# EasyEDA Pro project ProProject_Strain Gauge Paddle_2023-12-18.epro, board PCB1
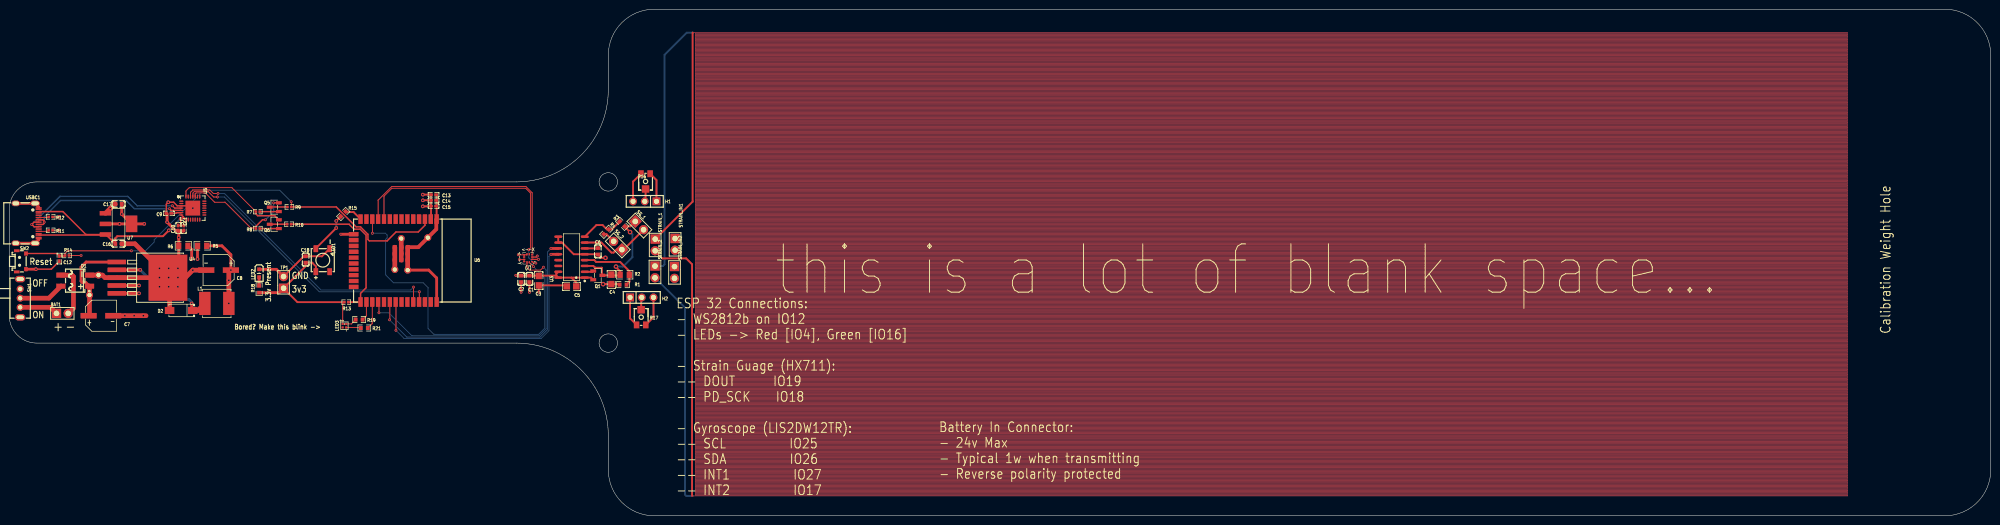
[diagram p3: board, top side]
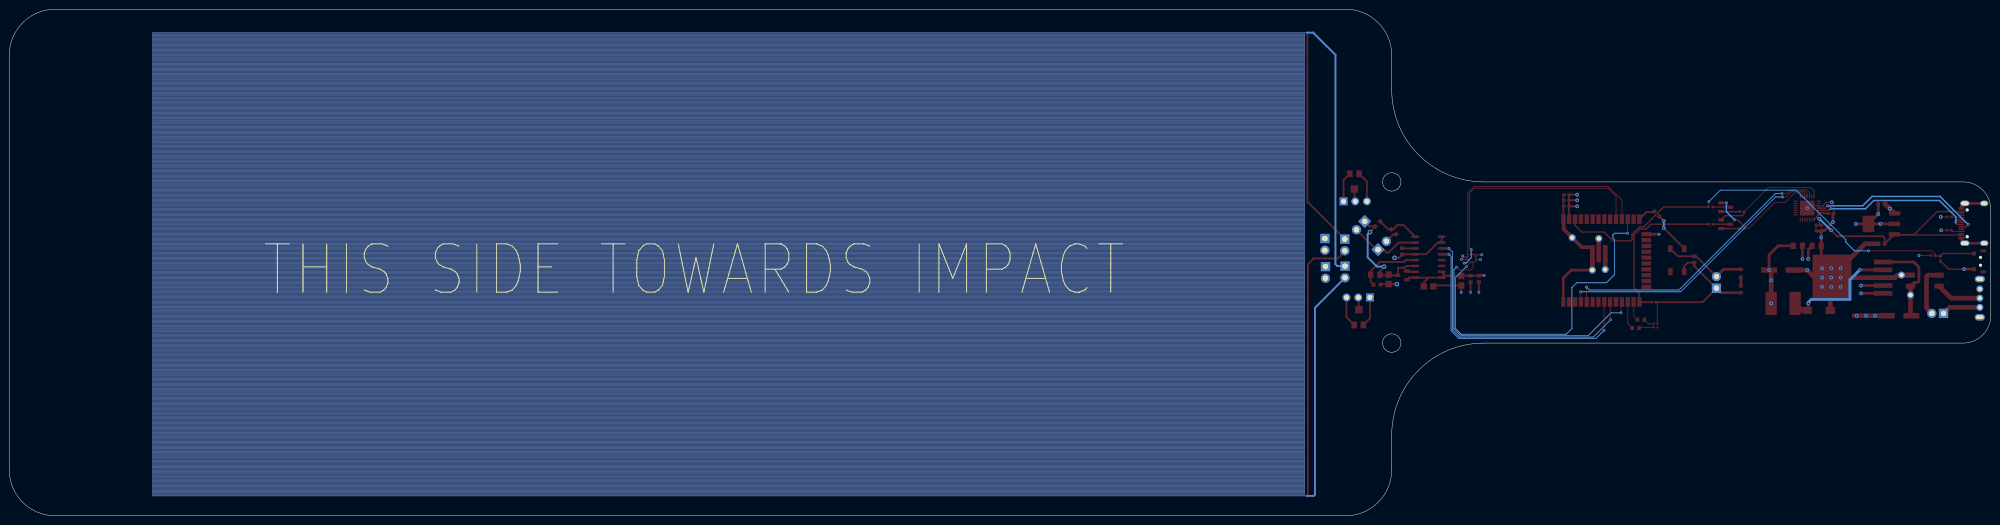
[diagram p4: board, bottom side, seen from below]

Outline 430 x 110 mm; copper layers: Top Layer, GND, 3V3, Bottom Layer. Coordinates in mm from the lower left corner of the outline.
Outline path: circle c130,72.5 r2 ; circle c130,37.5 r2 ; 0,66.5 arc(1.76,70.74) 6,72.5 110,72.5 arc(124.14,78.36) 130,92.5 130,100 arc(132.93,107.07) 140,110 420,110 arc(427.07,107.07) 430,100 430,10 arc(427.07,2.93) 420,0 140,0 arc(132.93,2.93) 130,10 130,17.5 arc(124.14,31.64) 110,37.5 6,37.5 arc(1.76,39.26) 0,43.5 0,66.5
Stack: Top Layer 0.035mm / Dielectric1 0.48mm PP er 4.5 / GND 0.035mm / Dielectric2 0.48mm FR4 er 4.5 / 3V3 0.035mm / Dielectric3 0.48mm PP er 4.5 / Bottom Layer 0.035mm

## Design rules (mm)
template: JLCPCB Capability(Two Layers Board)
spacing copperThickness1oz (default): track to track 0.102, other pairs 0.152 to 0.3
spacing copperThickness2oz: track to track 0.203, other pairs 0.152 to 0.3
track width copperThickness1oz (default): min 0.127, default 0.254, max 2.54
track width copperThickness2oz: min 0.203, default 0.254, max 2.54
differential pair differentialPair (default): width min 0.127, default 0.254, max 2.54; gap min 0.152, default 0.152
via viaSize (default): diameter min 0.5, default 0.61, max 10; hole min 0.3, default 0.305, max 6.3

## Placement (name value [footprint] x y rotation side)
BAT1  PZ254V-11-02P  [HDR-TH_2P-P2.54-V-M]  11.53 43.95 0 top
C1  100nF  [C0603]  112.88 51.44 90 top
C2  100nF  [C0603]  111.09 51.44 90 top
C3  10uF  [C0805]  114.92 51.06 90 top
C4  10uF  [C0805]  130.66 51.33 90 top
C5  10uF  [C0805]  122.02 49.81 180 top
C6  100nF  [C0603]  127.74 57.43 90 top
C7  470uF  [CAP-SMD_BD6.3-L6.6-W6.6-LS7.6-RD]  19.91 43.44 0 top
C8  330uF  [CAP-SMD_BD6.3-L6.6-W6.6-LS7.4-FD]  45.44 53.35 180 top
C9  100nF  [C0402]  34.64 65.67 0 top
C10  1uF  [C0402]  36.67 62.49 90 top
C11  100nF  [C0402]  37.9 62.49 90 top
C12  10uF  [C0402]  10.89 55.85 270 top
C13  10uF  [C0402]  92.08 69.73 180 top
C14  10uF  [C0402]  92.08 68.5 180 top
C15  10uF  [C0402]  92.08 67.23 180 top
C16  10uF  [C0603]  23.72 59.06 0 top
C17  10uF  [C0603]  23.72 67.7 180 top
C18  10uF  [C0603]  64.33 55.66 90 top
D1  MB10S  [MBS_L4.7-W3.8-P2.40-LS7.0-TL]  14.32 51.06 180 top
D2  SS54  [SMA_L4.4-W2.8-LS5.4-R-RD]  37.31 44.59 180 top
H1  PZ254V-11-03P  [HDR-TH_3P-P2.54-V-M]  137.91 68.28 180 top
H2  PZ254V-11-03P  [HDR-TH_3P-P2.54-V-M]  137.26 47.41 0 top
L1  22uH  [IND-SMD_L6.0-W6.0_SWPA6045S]  45.05 46.11 0 top
LED1  XL-5050RGBC-WS2812B  [LED-SMD_4P-L5.0-W5.0-BL_XL-5050RGBC]  68.04 55.51 0 top
LED2  BL-HJC36G-AV-TRB  [LED0603-R-RD_AMBER]  54.23 52.67 270 top
LED3  NH-B1010RGBT-HF  [LED-ARRAY-SMD_4P-L1.0-W1.0-TR_NH-B1010RGBT]  72.74 41.28 90 top
NOREF  -  [Pad_e5196]  83.67 53.48 0 top
NOREF#2  -  [Pad_e5195]  85.07 60.21 0 top
NOREF#3  -  [Pad_e6579]  17.42 47.93 0 top
NOREF#4  -  [Pad_e6573]  19.38 52.26 0 top
NOREF#5  -  [Pad_e5197]  86.47 53.35 0 top
NOREF#6  -  [Pad_e5198]  90.84 60.4 0 top
Q1  S8550  [SOT-23-3_L2.9-W1.3-P1.90-LS2.4-BR]  127.73 52.21 180 top
Q5  -  [SOT-23-3_L2.9-W1.3-P1.90-LS2.4-BR]  57.52 67.01 0 top
Q6  -  [SOT-23-3_L2.9-W1.3-P1.90-LS2.4-BR]  57.52 63.31 0 top
R1  6.65kΩ  [R0603]  133.2 50.19 0 top
R2  10kΩ  [R0805]  133.57 52.33 180 top
R3  1kΩ  [R0603]  133.02 63.38 135 top
R4  1kΩ  [R0603]  129.56 61.66 225 top
R5  0Ω  [R0805]  41.86 58.62 0 top
R6  0Ω  [R0805]  37.79 58.62 0 top
R7  10kΩ  [R0402]  53.94 66.05 0 top
R8  10kΩ  [R0402]  53.94 62.37 0 top
R9  100Ω  [R0402]  60.8 67.06 0 top
R10  100Ω  [R0402]  60.73 63.31 0 top
R11  5.1kΩ  [R0402]  8.99 61.98 180 top
R12  5.1kΩ  [R0402]  8.99 64.91 180 top
R13  10kΩ  [R0402]  73.14 46.39 180 top
R14  10kΩ  [R0402]  12.54 56.52 0 top
R15  330Ω  [R0603]  72.49 65.54 45 top
R16  300Ω  [RES-ADJ-SMD_VG039NCH]  138.08 72.62 90 top
R17  300Ω  [RES-ADJ-SMD_VG039NCH]  137.14 43.1 270 top
R18  100Ω  [R0603]  54.23 49.2 270 top
R19  100Ω  [R0603]  77.06 40.78 0 top
R21  100Ω  [R0603]  75.94 42.6 180 top
SG_1  PZ254V-11-02P  [HDR-TH_2P-P2.54-V-M]  136.75 63.02 315 top
SG_2  PZ254V-11-02P  [HDR-TH_2P-P2.54-V-M]  132.05 58.7 135 top
STRAIN_1  PZ254V-11-02P  [HDR-TH_2P-P2.54-V-M]  140.18 58.81 270 top
STRAIN_2  PZ254V-11-02P  [HDR-TH_2P-P2.54-V-M]  140.13 52.95 270 top
STRAIN_IN1  PZ254V-11-02P  [HDR-TH_2P-P2.54-V-M]  144.5 58.94 270 top
STRAIN_IN2  PZ254V-11-02P  [HDR-TH_2P-P2.54-V-M]  144.37 52.84 270 top
SW1  SK12D07VG4  [SW-TH_SK12D07VG4]  2.38 47.26 270 top
SW2  1TS003B-1400-3500A-CT  [KEY-SMD_1TS003B]  2.64 55.25 270 top
TP1  -  [HDR-TH_2P-P2.54-V-M]  59.53 50.68 90 top
U2  LIS2DW12TR  [LGA-12_L2.0-W2.0-P0.50-BL]  112.61 55.93 90 top
U3  HX711  [SOP-16_L10.0-W3.9-P1.27-LS6.0-BL]  122.02 56.16 90 top
U4  LM2575S-3.3  [TO-263-5_L10.0-W8.4-P1.70-LS15.3-BR]  28.9 51.7 180 top
U5  -  [WQFN-28_L5.0-W5.0-P0.50-BL-EP3.2]  39.85 66.81 270 top
U6  -  [WIFI-SMD_ESP32-WROOM-32E]  83.75 55.42 180 top
U7  AMS1117-3.3  [SOT-223-4_L6.5-W3.5-P2.30-LS7.0-BR]  23.72 63.38 180 top
USBC1  -  [USB-C_SMD-TYPE-C-31-M-12]  3.91 63.51 270 top

## Footprints (pads in the part's own frame, mm; a bottom-side part is the same pattern mirrored in y, then rotated)
C0402
  rect 0.79x0.54 smd: 1(-0.545,0) 2(0.545,0)
C0603
  rect 0.8x0.9 smd: 1(-0.7,0) 2(0.7,0)
C0805
  rect 1.41x1.35 smd: 1(-1.03,0) 2(1.03,0)
CAP-SMD_BD6.3-L6.6-W6.6-LS7.4-FD
  rect 3.5x1.2 smd: 1(-2.67,0) 2(2.67,0)
CAP-SMD_BD6.3-L6.6-W6.6-LS7.6-RD
  rect 3.5x1.2 smd: 1(-2.67,0) 2(2.67,0)
HDR-TH_2P-P2.54-V-M
  rect 2x2 hole 1.2: 1(-1.27,0)
  round 2 hole 1.2: 2(1.27,0)
HDR-TH_3P-P2.54-V-M
  rect 1.7x1.7 hole 1.1: 1(-2.54,0)
  round 1.7 hole 1.1: 2(0,0) 3(2.54,0)
IND-SMD_L6.0-W6.0_SWPA6045S
  rect 2.474x5.02 smd: 1(-2.603,0) 2(2.603,0)
KEY-SMD_1TS003B
  rect 0.9x0.8 smd: 1(1.7,1) 2(-1.7,1)
  rect 0.6x1.2 smd: 3(-2.3,-1) 4(2.3,-1)
LED0603-R-RD_AMBER
  rect 0.8x0.8 smd: 1(0.851,0) 2(-0.851,0)
LED-ARRAY-SMD_4P-L1.0-W1.0-TR_NH-B1010RGBT
  rect 0.45x0.45 smd: 1(0.385,0.385) 2(0.385,-0.385) 3(-0.385,-0.385) 4(-0.385,0.385)
LED-SMD_4P-L5.0-W5.0-BL_XL-5050RGBC
  rect 1x1.5 smd: 1(-1.5,-2.5) 2(1.5,-2.5) 3(1.5,2.5) 4(-1.5,2.5)
LGA-12_L2.0-W2.0-P0.50-BL
  rect 0.28x0.5 smd: 1(-0.75,-0.875) 2(-0.25,-0.875) 3(0.25,-0.875) 4(0.75,-0.875) 7(0.75,0.875) 8(0.25,0.875) 9(-0.25,0.875) 10(-0.75,0.875)
  rect 0.5x0.28 smd: 5(0.875,-0.25) 6(0.875,0.25) 11(-0.875,0.25) 12(-0.875,-0.25)
MBS_L4.7-W3.8-P2.40-LS7.0-TL
  rect 2x1.1 smd: 1(-3.1,1.2) 2(-3.1,-1.2) 3(3.1,-1.2) 4(3.1,1.2)
Pad_e5195
  round 1.524 hole 0.914: 1(0,0)
Pad_e5196
  round 1.524 hole 0.914: 2(0,0)
Pad_e5197
  round 1.524 hole 0.914: 3(0,0)
Pad_e5198
  round 1.524 hole 0.914: 4(0,0)
Pad_e6573
  round 1.524 hole 0.914: 5(0,0)
Pad_e6579
  round 1.524 hole 0.914: 6(0,0)
R0402
  rect 0.566x0.54 smd: 1(-0.433,0) 2(0.433,0)
R0603
  rect 0.806x0.864 smd: 1(-0.753,0) 2(0.753,0)
R0805
  rect 1.133x1.377 smd: 1(-1,0) 2(1,0)
RES-ADJ-SMD_VG039NCH
  rect 1.5x1.2 smd: 1(1.65,-1) 3(1.65,1)
  rect 1.6x1.6 smd: 2(-1.65,0)
SMA_L4.4-W2.8-LS5.4-R-RD
  rect 2.062x1.539 smd: 1(2.503,0) 2(-2.503,0)
SOP-16_L10.0-W3.9-P1.27-LS6.0-BL
  oval 0.56x1.745 smd: 1(-4.445,-2.873) 2(-3.175,-2.873) 3(-1.905,-2.873) 4(-0.635,-2.873) 5(0.635,-2.873) 6(1.905,-2.873) 7(3.175,-2.873) 8(4.445,-2.873) 9(4.445,2.873) 10(3.175,2.873) 11(1.905,2.873) 12(0.635,2.873) 13(-0.635,2.873) 14(-1.905,2.873) 15(-3.175,2.873) 16(-4.445,2.873)
SOT-23-3_L2.9-W1.3-P1.90-LS2.4-BR
  rect 1.25x0.7 smd: 1(1,-0.95) 2(1,0.95) 3(-1,0)
SOT-223-4_L6.5-W3.5-P2.30-LS7.0-BR
  rect 2.47x0.98 smd: 1(2.835,-2.3) 2(2.835,0) 3(2.835,2.3)
  rect 2.47x3.6 smd: 4(-2.835,0)
SW-TH_SK12D07VG4
  round 1.524 hole 0.914: 1(-2,0) 2(0,0) 3(2,0)
  oval 1.4x2.2 hole 0.8x1.6: 4(4.15,0) 5(-4.15,0)
TO-263-5_L10.0-W8.4-P1.70-LS15.3-BR
  rect 4x1.02 smd: 1(5.55,-3.4) 2(5.55,-1.7) 3(5.55,0) 4(5.55,1.7) 5(5.55,3.4)
  rect 8.4x10 smd: 6(-5.55,0)
USB-C_SMD-TYPE-C-31-M-12
  oval 1.2x2 hole 0.8x1.6: 0(-4.325,1.716) 0(4.325,1.716)
  oval 1.2x1.8 hole 0.8x1.4: 0(-4.325,-2.484) 0(4.325,-2.484)
  rect 0.3x1.3 smd: A1(-3.35,2.484) A4(-2.55,2.484) A5(-1.25,2.484) A6(-0.25,2.484) A7(0.25,2.484) A8(1.25,2.484) A9(2.55,2.484) A12(3.35,2.484) B1(3.05,2.484) B4(2.25,2.484) B5(1.75,2.484) B6(0.75,2.484) B7(-0.75,2.484) B8(-1.75,2.484) B9(-2.25,2.484) B12(-3.05,2.484)
WIFI-SMD_ESP32-WROOM-32E
  rect 0.95x2.1 smd: 1(-9.002,-9) 2(-7.732,-9) 3(-6.463,-9) 4(-5.192,-9) 5(-3.922,-9) 6(-2.652,-9) 7(-1.383,-9) 8(-0.113,-9) 9(1.157,-9) 10(2.428,-9) 11(3.697,-9) 12(4.968,-9) 13(6.237,-9) 14(7.508,-9) 25(7.508,9) 26(6.237,9) 27(4.968,9) 28(3.697,9) 29(2.428,9) 30(1.157,9) 31(-0.113,9) 32(-1.383,9) 33(-2.652,9) 34(-3.922,9) 35(-5.192,9) 36(-6.463,9) 37(-7.732,9) 38(-9.002,9)
  rect 2.1x0.95 smd: 15(9.002,-5.715) 16(9.002,-4.445) 17(9.002,-3.175) 18(9.002,-1.905) 19(9.002,-0.635) 20(9.002,0.635) 21(9.002,1.905) 22(9.002,3.175) 23(9.002,4.445) 24(9.002,5.715)
  rect 0.9x0.9 smd: 39(-2.721,-0.1) 39(-2.721,-1.5) 39(-2.721,-2.9) 39(-1.321,-0.1) 39(-1.321,-1.5) 39(-1.321,-2.9) 39(0.079,-0.1) 39(0.079,-1.5) 39(0.079,-2.9)
WQFN-28_L5.0-W5.0-P0.50-BL-EP3.2
  oval 0.28x0.9 smd: 1(-1.502,-2.5) 2(-1.001,-2.5) 3(-0.5,-2.5) 4(0,-2.5) 5(0.5,-2.5) 6(1,-2.5) 7(1.501,-2.5) 15(1.501,2.5) 16(1,2.5) 17(0.5,2.5) 18(0,2.5) 19(-0.5,2.5) 20(-1.001,2.5) 21(-1.502,2.5)
  oval 0.9x0.28 smd: 8(2.5,-1.502) 9(2.5,-1.001) 10(2.5,-0.5) 11(2.5,0) 12(2.5,0.5) 13(2.5,1) 14(2.5,1.501) 22(-2.5,1.501) 23(-2.5,1) 24(-2.5,0.5) 25(-2.5,0) 26(-2.5,-0.5) 27(-2.5,-1.001) 28(-2.5,-1.502)
  rect 3.2x3.2 smd: 29(0,0)

## Nets
As in the schematic, except:
3V3: C1.2 C2.2 C3.2 C5.1 C8.1 C13.2 C14.2 C15.2 C17.1 C18.1 L1.2 LED1.1 LED3.1 Q1.2 R5.2 R13.2 R14.2 R18.2 TP1.1 U2.9 U2.10 U3.1 U3.15 U3.16 U6.2 U7.2 U7.4
AGND: C4.1 C6.1 R1.1 R4.2 SG_2.2 U3.5 U3.9 U3.10
GND: C1.1 C2.1 C3.1 C5.2 C7.2 C8.2 C9.1 C10.1 C11.1 C12.2 C13.1 C14.1 C15.1 C16.2 C17.2 C18.2 D1.2 D2.1 LED1.3 LED2.2 NOREF.2 NOREF#2.1 NOREF#4.5 NOREF#5.3 NOREF#6.4 R6.1 R11.1 R12.1 SW2.1 TP1.2 U2.6 U2.7 U2.8 U4.3 U4.6 U5.3 U5.29 U6.1 U6.15 U6.38 U6.39 U7.1 USBC1.0 USBC1.A1 USBC1.A12 USBC1.B1 USBC1.B12
BATT_POS: C7.1 D1.1 NOREF#3.6 U4.1

Pads without a net: LED1 2; LED3 4; SW1 1 4 5; SW2 3 4; U2 2 3 5; U3 13 14; U5 1 2 9 10 11 12 13 14 15 16 17 18 19 20 21 22 23 27; U6 4 5 6 7 8 9 13 16 17 18 19 20 21 22 23 24 29 32 33 36 37; USBC1 A8 B8

## Via types
v1: diameter 0.61, hole 0.305, Top Layer to Bottom Layer, 2 vias
v2: diameter 0.8, hole 0.4, Top Layer to Bottom Layer, 40 vias
v3: diameter 0.6, hole 0.3, Top Layer to Bottom Layer, 30 vias
v4: diameter 1, hole 0.5, Top Layer to Bottom Layer, 4 vias

## Routing (per net, layer and track width the routed paths; a pad name or vN(x,y) marks a point on that pad's centre or on a via; arc(x,y) is an arc through that point)
3V3: length 162.4
  Top Layer w0.2: 111.69,55.63 v3(110.71,55.63) ; 111.69,55.63 111.73,55.59 U2.10 ; 111.69,55.63 U2.9 ; R14.2 v3(15.59,56.52) ; LED3.1 72.36,46.03 R13.2
  Top Layer w0.4: C5.1 123.05,50.65 121.99,51.71 ; U6.2 91.53,64.47 C15.2 ; 118.72,52.14 U3.16 121.99,51.71 ; 118.72,52.14 118.72,52.55 U3.15 ; 118.72,52.14 C1.2 C2.2 ; C14.2 C15.2 ; C14.2 v2(89.76,68.5) ; C14.2 C13.2 v2(89.76,69.73) ; C15.2 arc(91.49,67.2) 91.43,67.19 v2(89.76,67.19) ; LED1.1 66.54,54.17 65.76,54.96 C18.1 64.33,54.21 TP1.1 62.56,46.39 R13.2 ; 121.99,51.71 U3.1 126.28,51.71 Q1.2
  Top Layer w0.6: R5.2 46.16,58.62 48.11,56.68 v2(48.11,53.35) ; v3(109.95,52.21) 111.03,52.21 C2.2 ; TP1.1 58.57,48.45 R18.2 ; C17.1 v2(24.42,65.52) U7.4 ; U7.4 v2(29.31,63.38) ; U7.4 v2(23.95,63.38) U7.2
  Top Layer w1: v2(48.11,53.35) 47.66,52.9 v2(47.66,51.14) v2(47.66,46.11)
  3V3 w0.2: v2(23.95,63.38) 23.97,63.35 23.97,62.11 18.38,56.52 v3(15.59,56.52)
  3V3 w0.6: 90.39,42.17 93.57,39 109.06,39 109.95,39.89 v3(109.95,52.21) 109.95,54.87 v3(110.71,55.63) ; v2(23.95,63.38) v2(29.31,63.38) 27.17,65.52 v2(24.42,65.52)
AGND: length 19.3
  Top Layer w0.4: v4(129.38,56.02) 128.45,56.02 C6.1 127.67,56.79 U3.5 122.51,56.79 119.97,59.33 U3.10 U3.9 ; 129.03,61.13 129.62,61.13 SG_2.2 ; R1.1 132.33,50.3 C4.1 ; 130.66,50.3 v4(128.87,50.3)
GND: length 179.6
  Top Layer w0.2: U2.7 112.23,56.68 U2.6 ; U2.7 U2.8 ; U2.7 v3(110.46,56.68) ; R12.1 10.76,64.91 ; R11.1 v2(10.76,61.98)
  Top Layer w0.3: v2(39.85,66.81) 39.35,67.31 U5.3 36.46,67.31 35.69,68.08 v2(34.51,68.08) 34.1,67.66 C9.1 ; C12.2 9.14,53.55 v2(5.81,53.55)
  Top Layer w0.4: U6.1 92.75,69.61 C13.1 ; TP1.2 63.94,56.36 C18.2 67.89,56.36 LED1.3 ; C1.1 v3(112.88,48.52) ; C5.2 120.77,50.03 C3.1 v3(114.92,48.52) ; C2.1 v3(111.09,48.52)
  Top Layer w0.6: U4.6 36.79,54.04 R6.1 v2(36.79,60.44) 36.79,61.83 ; U6.15 v3(71.98,61.14) ; C9.1 34.26,65.5 v2(34.26,63.76) 36.07,61.95 C10.1 36.79,61.83 ; USBC1.0 5.62,67.83 6.39,67.07 6.39,66.86 ; SW2.1 v2(5.81,53.55) ; LED2.2 57.96,53.52 TP1.2 ; 6.39,60.16 6.39,59.95 5.62,59.18 USBC1.0 ; 36.79,61.83 37.79,61.83 C11.1 ; 92.75,46.42 92.75,51.62 91.03,53.35 NOREF#5.3
  Top Layer w0.8: U6.39 88.76,58.32 NOREF#6.4 92.68,62.24 92.68,64.35 U6.1
  Top Layer w1: C7.2 v2(25.1,43.44) v2(27.1,43.44) v2(29.1,43.44) 29.69,43.44 ; D1.2 NOREF#4.5 20.24,52.26 20.8,51.7 U4.3 U4.6 ; NOREF#2.1 U6.39 U6.39 U6.39 ; U4.6 34.8,51.35 D2.1 ; U4.6 38.2,51.7 v2(39.85,53.35) C8.2 ; U7.1 v2(21.91,66.71) 22.9,67.7 23.02,67.7 ; C16.2 27.27,59.06 v2(32.61,53.73) ; NOREF.2 U6.39 U6.39 U6.39 ; NOREF#5.3 U6.39 U6.39 U6.39
  vias: v2(10.87,64.91) v2(32.61,51.73) v2(32.61,49.73) v2(34.61,53.73) v2(34.61,51.73) v2(34.61,49.73) v2(36.61,53.73) v2(36.61,51.73) v2(36.61,49.73)
(no net): length 2.6
  Top Layer w0.254: U2.2 v1(114.85,55.68) ; v1(114.59,56.41) 114.37,56.18 U2.3
BATT_POS: length 20
  Top Layer w0.6: U4.1 16.71,55.1 15.59,53.98 15.59,50.94 15.84,50.68 16.6,50.68 D1.1
  Top Layer w1: C7.1 17.42,43.62 NOREF#3.6 D1.1
BLINK_GREEN: length 6
  Top Layer w0.2: R19.2 78.78,41.75 78.78,46.42
BLINK_RED: length 4.2
  Top Layer w0.2: 77.51,46.42 77.51,43.42 76.69,42.6
CP_DTR: length 24.9
  Top Layer w0.2: U5.28 38.35,70.52 39.09,71.26 48.3,71.26 R7.1
  Top Layer w0.3: R7.1 53.51,65.58 53.93,65.16 57.62,65.16 Q6.2
CP_RTS: length 25.4
  Top Layer w0.2: 53.18,62.49 52.42,62.49 46.83,68.08 44.58,68.08 42.55,70.11 40.55,70.11 40.35,69.91 U5.24
  Top Layer w0.3: Q5.2 58.51,67.95 v3(57.37,67.95) ; R8.1 53.51,62.84 54.95,64.27 v3(55.6,64.27)
  Bottom Layer w0.3: v3(57.37,67.95) 57.37,66.05 v3(55.6,64.27)
ESP_EN: length 101.9
  Top Layer w0.2: R9.2 61.24,68.16 v3(61.18,68.21) ; v3(26.51,57.54) 12.7,57.54 12.11,56.94 R14.1
  Top Layer w0.3: SW2.2 10.33,56.95 C12.1 11.98,56.4 R14.1 ; R9.2 70.96,67.06 75.28,62.75 76.23,62.75 77.84,61.14 77.84,60 78.14,59.7 82.01,59.7 83.94,61.62 88.76,61.62 90.21,63.07 U6.3
  Bottom Layer w0.2: v3(61.18,68.21) 58.7,70.69 42.21,70.69 31.47,59.95 31.47,59.44 29.56,57.54 v3(26.51,57.54)
ESP_IO0: length 35
  Top Layer w0.3: 76.24,46.42 76.24,48.31 77.44,49.51 77.44,60.97 76.17,62.24 74.81,62.24 73.74,63.31 R10.2
  Top Layer w0.4: 76.24,46.42 76.21,46.39 R13.1
ESP_RXD: length 62
  Top Layer w0.2: v3(45.31,69.99) 44.29,69.99 43.53,70.75 39.85,70.75 39.35,70.25 U5.26 ; 87.67,46.42 87.73,46.48 v3(87.73,49.67)
  Bottom Layer w0.2: v3(87.73,49.67) 87.09,49.03 67.66,49.03 46.71,69.99 v3(45.31,69.99)
ESP_TXD: length 61.3
  Top Layer w0.2: U5.25 39.85,70.07 40.23,70.45 43.15,70.45 44.37,69.22 v3(45.18,69.22) ; v3(89,48.65) 89,46.48 88.94,46.42
  Bottom Layer w0.2: v3(45.18,69.22) 46.71,69.22 67.28,48.65 v3(89,48.65)
GYR_INT1: length 76.4
  Top Layer w0.2: U6.12 78.82,64.38 v3(78.82,61.35) ; U2.12 112.86,55.01 v3(113.76,54.11)
  Bottom Layer w0.2: 78.96,61.35 81.63,61.35 82.01,60.97 82.01,60.33 81.68,60 81.68,52.33 83.41,50.6 89.84,50.6 90.9,49.54 90.9,40.65 92.15,39.4 114.88,39.4 116.2,40.73 116.2,51.67 v3(113.76,54.11)
GYR_INT2: length 60.2
  Top Layer w0.2: v3(80.23,44.08) 80.23,46.24 80.05,46.42 ; U2.11 112.36,53.89 112.9,53.35 115.29,53.35 v3(115.92,53.98)
  Bottom Layer w0.2: v3(80.23,44.08) 82.39,44.08 87.38,39.09 115,39.09 116.51,40.6 116.51,53.4 v3(115.92,53.98)
LED_DATA: length 3.9
  Top Layer w0.4: U6.14 74.72,65.95 73.02,65.95
S_A1: length 9.7
  Top Layer w0.4: U3.8 127.42,63.13 128.75,63.13 129.68,62.19 R4.1 130.77,62.19 132.49,63.91
S_A2: length 15.7
  Top Layer w0.4: SG_1.2 133.33,57.8 131.8,57.8 131.16,57.16 130.67,57.16 128.49,59.33 U3.7
S_AVDD: length 26.2
  Top Layer w0.4: U3.3 126.75,54.25 127.14,53.86 128.62,53.86 128.62,52.32 Q1.3 132.45,52.21 R2.2 132.57,53.08 131.67,53.98 v4(131.67,54.11) ; v4(134.72,61.6) 133.55,62.77 R3.1 134.79,62.85 SG_1.1
  Bottom Layer w0.4: v4(134.72,61.6) 135.22,61.1 135.22,56.14 133.19,54.11 v4(131.67,54.11)
S_BASE: length 1.9
  Top Layer w0.4: Q1.1 126.56,52.98 U3.2
S_DOUT: length 59.2
  Top Layer w0.2: v3(83.92,40.27) 83.92,46.37 83.86,46.42
  Top Layer w0.6: U3.12 119.13,56.78 v3(117.57,56.78)
  Bottom Layer w0.2: v3(83.92,40.27) 85.69,38.49 115.41,38.49 117.11,40.19 117.11,56.32 v3(117.57,56.78)
S_PD_SCK: length 60
  Top Layer w0.2: 82.59,46.42 82.59,42.63 v3(82.52,42.55)
  Top Layer w0.6: v3(117.57,58.05) 119.13,58.05 U3.11
  Bottom Layer w0.2: v3(82.52,42.55) 86.28,38.79 115.21,38.79 116.81,40.39 116.81,57.29 v3(117.57,58.05)
S_VFB: length 13.9
  Top Layer w0.4: R1.2 134.57,50.81 R2.1 134.57,53.11 132.56,55.12 127.36,55.12 126.95,55.52 U3.4
SCL_1: length 55
  Top Layer w0.2: v3(114.27,54.87) 113.79,54.87 U2.1 ; v3(112.75,57.79) 113.1,58.15 113.1,70.09 112.08,71.11 83.05,71.11 81.32,69.39 U6.10
  Bottom Layer w0.2: v3(112.75,57.79) 112.75,56.02 113.89,54.87 v3(114.27,54.87)
SDA_1: length 52.8
  Top Layer w0.2: 80.05,64.42 80.05,68.54 83.02,71.51 112.11,71.51 113.48,70.14 U2.4
USB_CC1: length 2.2
  Top Layer w0.2: R12.2 8.41,64.76 6.39,64.76
USB_CC2: length 2.3
  Top Layer w0.2: 6.39,61.76 8.33,61.76 R11.2
USB_D+: length 39.1
  Top Layer w0.3: 6.39,63.76 6.39,63.76 5.38,63.76 5.05,63.43 5.05,63.13 5.42,62.76 6.39,62.76 ; v3(35.4,67.32) 35.91,66.81 U5.4
  Bottom Layer w0.3: 5.05,63.38 11.02,69.35 25.75,69.35 27.78,67.32 v3(35.4,67.32)
  vias: v3(4.88,63.26)
USB_D-: length 36.4
  Top Layer w0.3: v3(34.77,66.68) 35.14,66.31 U5.5 ; 6.39,63.26 7.34,63.26 7.63,63.54 7.63,63.97 7.34,64.26 6.39,64.26
  Bottom Layer w0.3: v3(7.59,63.76) 7.59,64.91 11.15,68.46 25.37,68.46 27.15,66.68 v3(34.77,66.68)
V_BUS: length 56.3
  Top Layer w0.3: 37.81,64.84 U5.8 ; 37.81,64.84 37.21,64.24 37.21,63.04 ; 37.81,64.84 U5.7 ; 6.69,60.96 6.39,61.26 ; 6.69,60.96 6.39,60.96 ; 6.69,60.96 20.76,60.96 U7.3 16.62,61.08 11.64,66.06 6.39,66.06 ; 37.21,63.04 C11.2 ; 37.21,63.04 C10.2
  Top Layer w0.4: U7.3 21,61.08 23.02,59.06 23.02,60.27 23.46,60.71 33.37,60.71 v2(34.64,61.98)
  Bottom Layer w0.4: v2(37.2,64.49) 37.14,64.49 v2(34.64,61.98)
$1N315: length 9.9
  Top Layer w1: SW1.2 8.62,47.26 D1.4
$1N361: length 11.3
  Top Layer w1: D1.3 13.63,52.26 13.94,51.95 13.94,45.09 BAT1.2
$1N365: length 8.4
  Top Layer w1: SW1.3 8.95,45.26 BAT1.1
$1N666: length 26.8
  Top Layer w0.6: v2(39.59,46.11) 39.59,44.8 D2.2 ; U4.2 v2(28.42,53.4)
  Top Layer w1: L1.1 40.93,44.59 D2.2
  Bottom Layer w0.6: v2(28.42,53.4) 30.58,51.24 30.58,47 38.96,47 39.59,46.36 v2(39.59,46.11)
$1N1107: length 28.7
  Top Layer w0.6: R5.1 v2(40.86,55.76) ; U4.4 v2(28.16,50)
  3V3 w0.6: v2(28.16,50) 30.53,47.63 38.58,47.63 41.5,50.55 41.5,55.12 v2(40.86,55.76)
$1N1165: length 30.2
  Top Layer w0.6: v2(39.59,55.76) 39.59,57.81 R6.2 ; U4.5 v2(28.16,48.3)
  GND w0.6: v2(39.59,55.76) 39.34,56.02 28.29,56.02 25.37,53.09 25.37,49.92 27.02,48.27 28.13,48.27 v2(28.16,48.3)
$1N3382: length 9.4
  Top Layer w0.4: LED1.4 66.54,58.07 v2(70.96,62.49) 71.09,62.62 ; 71.95,64.88 71.83,64.88 v2(70.96,64.02)
  Bottom Layer w0.4: v2(70.96,62.49) v2(70.96,64.02)
$1N3717: length 1.9
  Top Layer w0.6: LED2.1 R18.1
$1N4432: length 3.2
  Top Layer w0.2: R19.1 76.18,40.9 LED3.3
$1N4504: length 2.4
  Top Layer w0.2: LED3.2 74.25,41.67 R21.2
$2N1710: length 2.9
  Top Layer w0.4: C6.2 127.67,58.06 U3.6
$2N2425: length 107.8
  Top Layer w0.4: 148.18,4.33 148.18,54.62 146.91,55.89 141.7,55.89 140.18,57.41 STRAIN_1.2 ; 148.31,104.91 148.31,68.21 STRAIN_1.1
$2N2441: length 107.6
  Bottom Layer w0.4: 148.43,104.91 147.04,104.91 142.21,100.08 142.21,54.62 141.81,54.22 STRAIN_2.1 ; STRAIN_2.2 146.65,45.16 146.65,4.58 146.91,4.33 148.43,4.33
$2N3141: length 6.7
  Top Layer w0.4: H1.3 135.37,72.56 R16.3
$2N3145: length 6.6
  Top Layer w0.4: H1.1 140.45,72.9 R16.1
$2N3149: length 2.8
  Top Layer w0.4: H1.2 138.08,68.45 R16.2
$2N3226: length 6.7
  Top Layer w0.4: H2.3 139.81,43.11 R17.3
$2N3229: length 6.6
  Top Layer w0.4: R17.1 134.72,42.86 H2.1
$2N3232: length 2.7
  Top Layer w0.4: H2.2 137.14,47.29 R17.2
$2N3295: length 103
  GND w0.4: 148.43,4.33 147.54,4.33 146.27,5.6 146.27,57.29 145.89,57.67 STRAIN_IN1.2 ; STRAIN_IN1.1 144.5,101.74 147.67,104.91 148.31,104.91
$2N3339: length 104.5
  3V3 w0.4: STRAIN_IN2.2 146.15,51.57 146.65,51.06 146.65,5.47 147.8,4.33 148.43,4.33 ; 148.31,104.91 147.29,104.91 146.78,104.4 146.78,54.62 146.27,54.11 STRAIN_IN2.1
$3N1098: length 3.9
  Top Layer w0.3: Q5.3 56.57,67.06 R9.1
$3N1099: length 3.8
  Top Layer w0.3: Q6.3 60.3,63.31
$3N1100: length 4.1
  Top Layer w0.3: R8.2 58.51,62.37 Q6.1
$3N1101: length 4.1
  Top Layer w0.3: R7.2 58.5,66.05 Q5.1
$3N1118: length 2.2
  Top Layer w0.3: U5.6 36.29,65.81 36.15,65.67 C9.2

## Copper pours and planes (outline as drawn; the poured copper is in the pictures)
3V3 on 3V3: 26.59,70.02 26.61,70.3 26.67,70.58 26.77,70.85 26.91,71.1 27.08,71.33 27.28,71.53 27.51,71.7 27.76,71.84 28.03,71.93 28.3,72 28.59,72.02 90.71,72.02 91,72 91.28,71.93 91.54,71.84 91.79,71.7 92.02,71.53 92.22,71.33 92.4,71.1 92.53,70.85 92.63,70.58 92.69,70.3 92.71,70.02 92.71,40.02 92.69,39.73 92.63,39.45 92.53,39.19 92.4,38.93 92.22,38.71 92.02,38.5 91.79,38.33 91.54,38.2 91.28,38.1 91,38.04 90.71,38.02 28.59,38.02 28.3,38.04 28.03,38.1 27.76,38.2 27.51,38.33 27.28,38.5 27.08,38.71 26.91,38.93 26.77,39.19 26.67,39.45 26.61,39.73 26.59,40.02
AGND on GND: 122.02,73.57 122.04,73.86 122.1,74.14 122.2,74.4 122.33,74.66 122.51,74.88 122.71,75.09 122.94,75.26 123.19,75.39 123.45,75.49 123.73,75.55 124.02,75.57 140.34,75.57 140.62,75.55 140.9,75.49 141.17,75.39 141.42,75.26 141.65,75.09 141.85,74.88 142.02,74.66 142.16,74.4 142.26,74.14 142.32,73.86 142.34,73.57 142.34,36.17 142.32,35.89 142.26,35.61 142.16,35.34 142.02,35.09 141.85,34.86 141.65,34.66 141.42,34.49 141.17,34.35 140.9,34.25 140.62,34.19 140.34,34.17 124.02,34.17 123.73,34.19 123.45,34.25 123.19,34.35 122.94,34.49 122.71,34.66 122.51,34.86 122.33,35.09 122.2,35.34 122.1,35.61 122.04,35.89 122.02,36.17
GND on GND: 3.6,70.02 3.62,70.3 3.68,70.58 3.78,70.85 3.92,71.1 4.09,71.33 4.29,71.53 4.52,71.7 4.77,71.84 5.04,71.93 5.32,72 5.6,72.02 114.59,72.02 114.87,72 115.15,71.93 115.42,71.84 115.67,71.7 115.9,71.53 116.1,71.33 116.27,71.1 116.41,70.85 116.51,70.58 116.57,70.3 116.59,70.02 116.59,40.02 116.57,39.73 116.51,39.45 116.41,39.19 116.27,38.93 116.1,38.71 115.9,38.5 115.67,38.33 115.42,38.2 115.15,38.1 114.87,38.04 114.59,38.02 5.6,38.02 5.32,38.04 5.04,38.1 4.77,38.2 4.52,38.33 4.29,38.5 4.09,38.71 3.92,38.93 3.78,39.19 3.68,39.45 3.62,39.73 3.6,40.02

## Text on the board
Bottom Silkscreen Layer: THIS SIDE TOWARDS IMPACT
Top Silkscreen Layer: <--X | <--Y | (Z) | 3.3v Present | Bored? Make this blink -> | Reset | OFF | ON | GND | 3v3 | + | - | ESP 32 Connections: / - WS2812b on IO12 / - LEDs -> Red [IO4], Green [IO16] / - Strain Guage (HX711): / -- DOUT      IO19 / -- PD_SCK    IO18 / - Gyroscope (LIS2DW12TR): / -- SCL          IO25 / -- SDA          IO26 / -- INT1          IO27 / -- INT2          IO17 | Battery In Connector: / - 24v Max / - Typical 1w when transmitting / - Reverse polarity protected | Calibration Weight Hole | this is a lot of blank space...
